# EasyEDA schematic SCH_Fermenter.json
TITLE: Fermentation Controller; REV: 1.0; Date: 2021-01-04; Sheet: 1/1; Drawn By: Mikael Hakansson; Company: Your Company
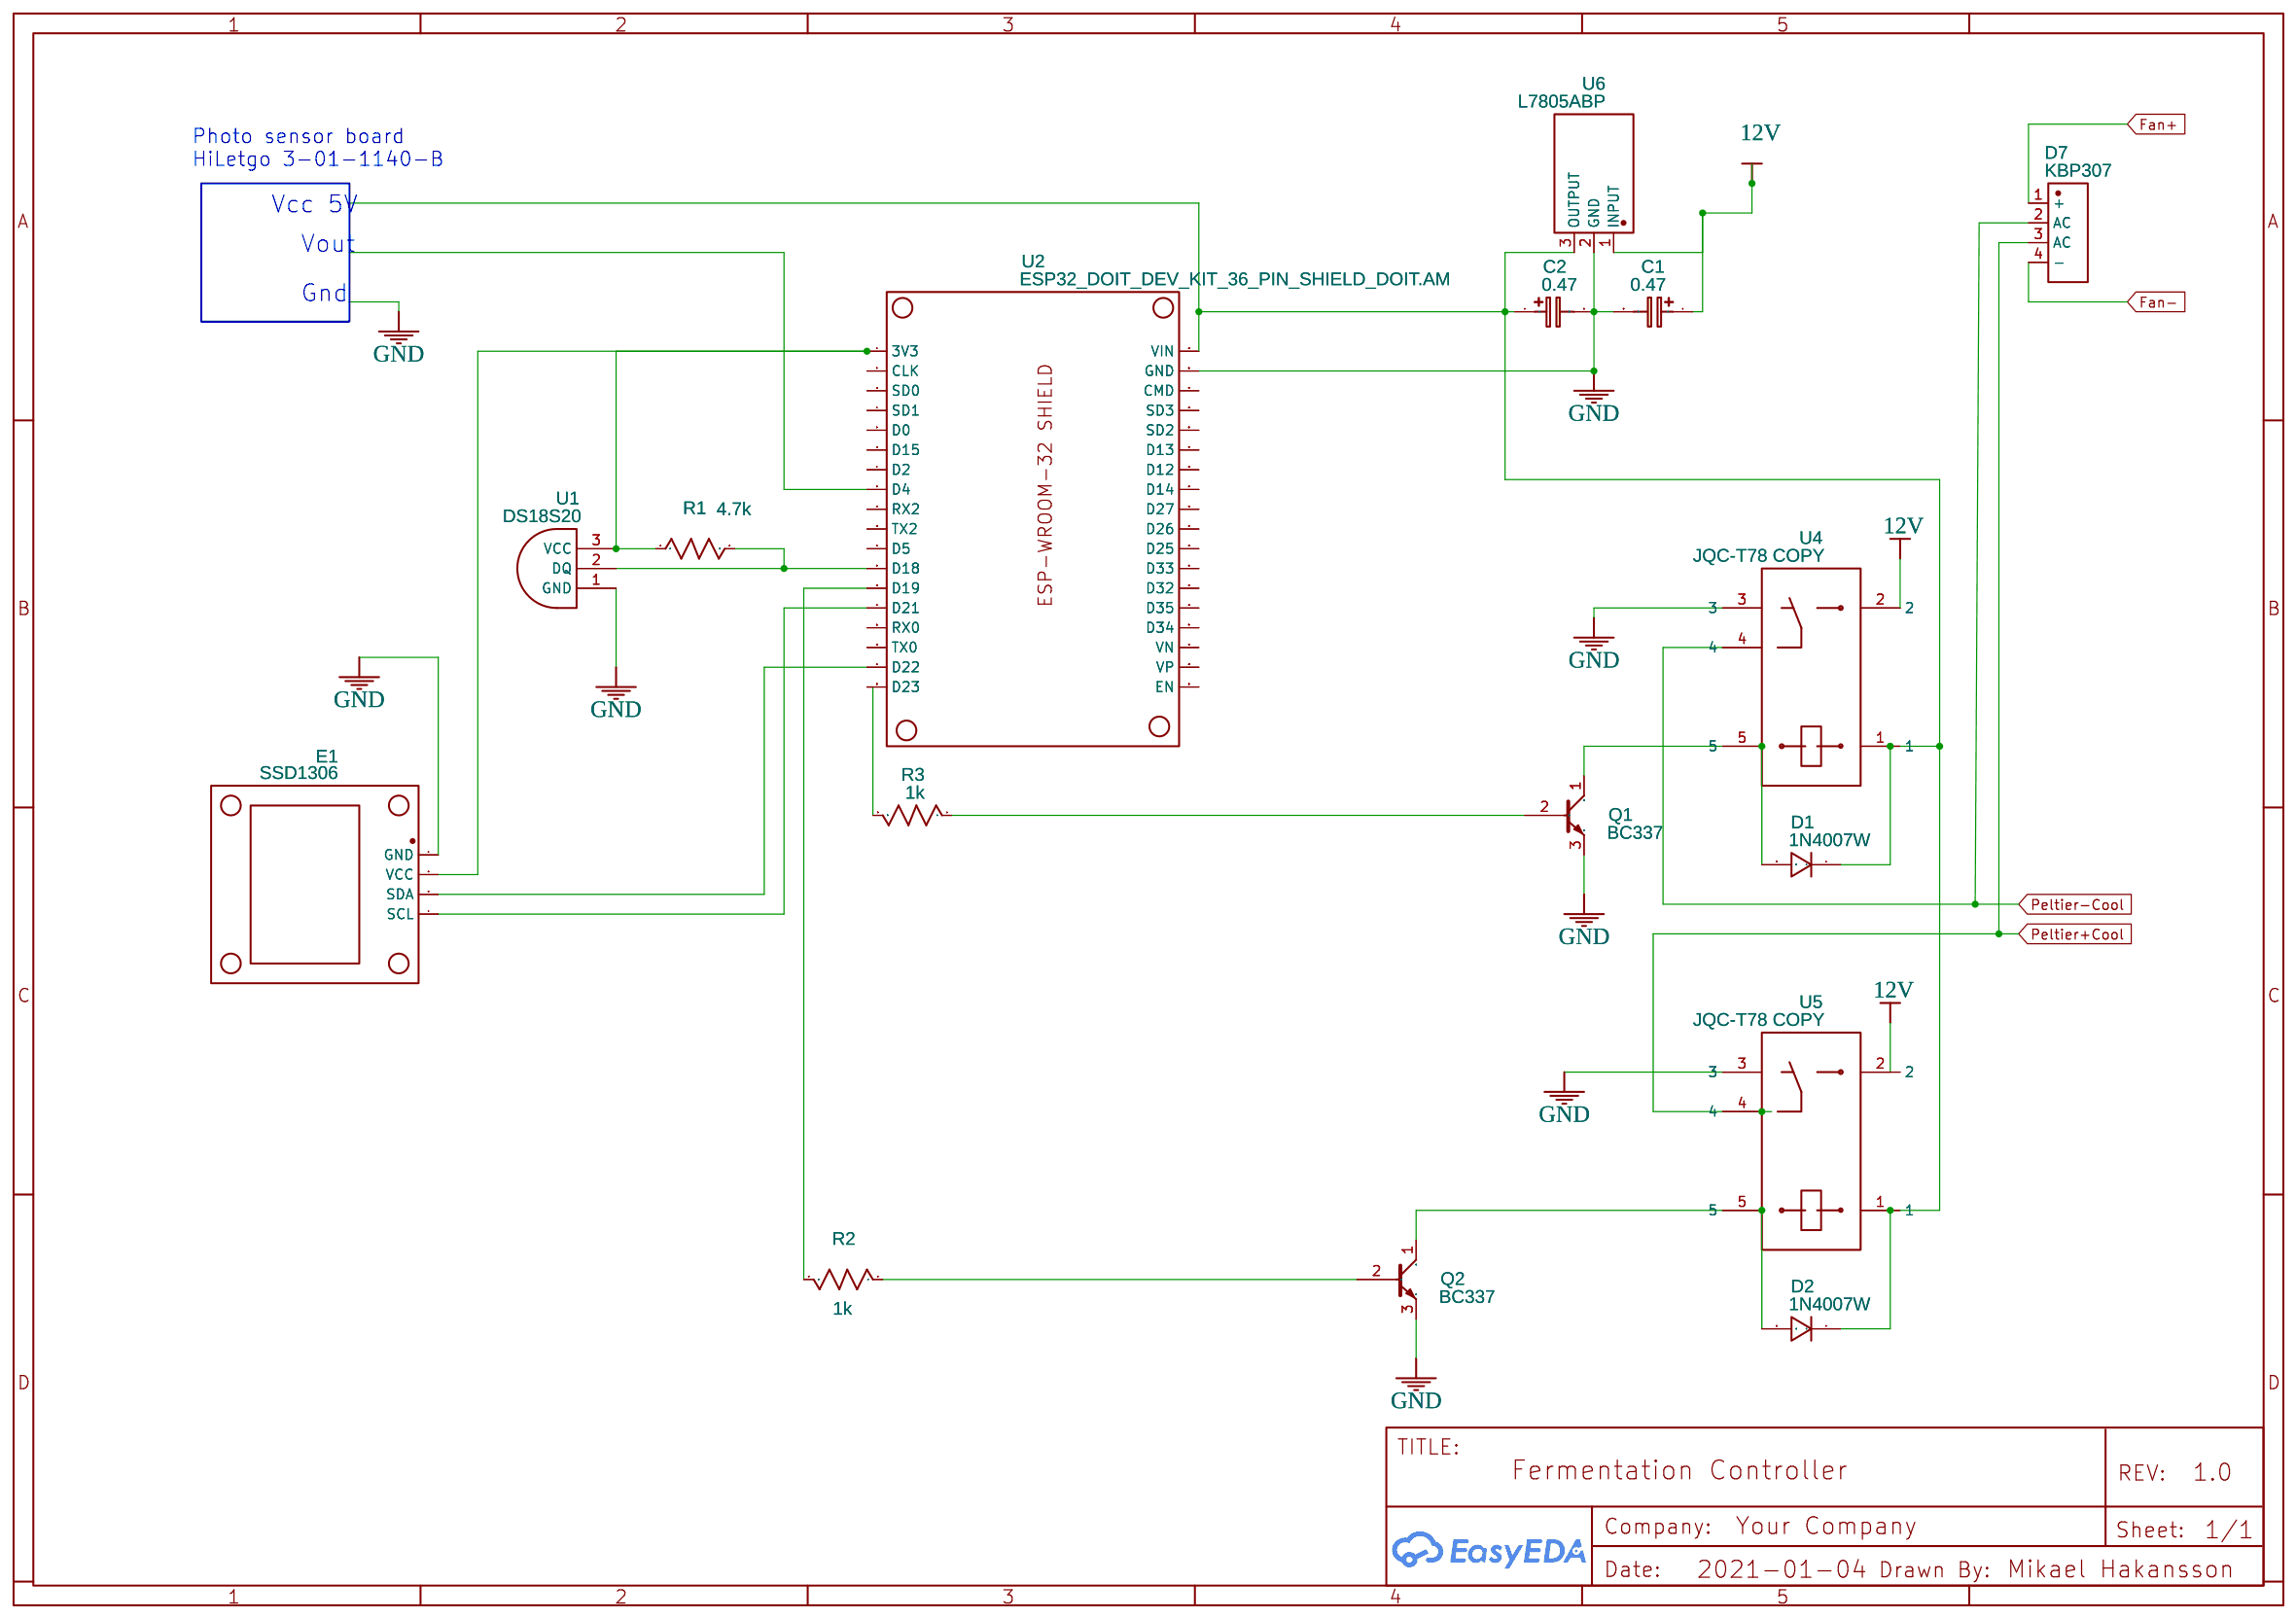
[diagram p0: schematic sheet]

## Parts
C1  0.47  [CASE-A_3216]
C2  0.47  [CASE-A_3216]
D1  1N4007W  [SOD-123_L2.8-W1.8-LS3.7-RD]
D2  1N4007W  [SOD-123_L2.8-W1.8-LS3.7-RD]
D7  KBP307  [KBP_4P-L14.8-W3.8-P3.85-L]
E1  SSD1306  [WJ2EDGVC-5.08-4P]
Q1  BC337  [TO-92_INLINE]
Q2  BC337  [TO-92_INLINE]
R1  4.7k  [AXIAL-6.5X2.3(1/4W)]
R2  1k  [R0603]
R3  1k  [R0603]
U1  DS18S20  [TO-92-3_L4.9-W3.7-P1.27-L]
U2  ESP32_DOIT_DEV_KIT_36_PIN_SHIELD_DOIT.AM  [ESP32_DOIT_DEVKIT_36_PIN]
U4  JQC-T78 COPY  [JQC-T78 COPY]
U5  JQC-T78 COPY  [JQC-T78 COPY]
U6  L7805ABP  [TO-220-3_L10.0-W4.5-P2.54-L]

## Library data of the parts
C1 C2 = C_Tan_SMD_A_EU: Contributor: LCEDA_Lib
D1 D2 = 1N4007W: Supplier: LCSC; Supplier Part: C328592; Manufacturer: BLUE ROCKET; Contributor: LCEDA_Lib
D7 = KBP307: Supplier: LCSC; Manufacturer: MDD; Supplier Part: C20648; JLCPCB Part Class: Extended Part
E1 = SSD1306: Supplier: LCSC; Manufacturer: ReliaPro; image: //image.lceda.cn/szlcsc/C8436.jpg; Supplier Part: C8436
Q1 Q2 = BC337: Contributor: Sanjay P Krishna
R1-R3 = R_0603_US: Contributor: LCEDA_Lib
U1 = DS18S20: Contributor: CodeWizard1975; Supplier: LCSC; Manufacturer: MAXIM; image: //image.lceda.cn/szlcsc/C52574.jpg; Supplier Part: C52574
U2 = ESP32_DOIT_DEV_KIT_36_PIN_SHIELD_DOIT.AM: Supplier: Mouser; Contributor: aloisiosjr
U4 U5 = JQC-T78 COPY: Contributor: AqibMalik
U6 = L7805ABP: Supplier: LCSC; Supplier Part: C2935188; Manufacturer: ST(意法半导体); Contributor: LCSC

## Nets
12V: C1.1 U4.2 U5.2 U6.1(INPUT)
GND: C1.2 C2.2 E1.1(GND) Q1.3(E) Q2.3(E) U1.1(GND) U2.35(GND) U4.3 U5.3 U6.2(GND)
Fan+: D7.1(+)
Fan-: D7.4(-)
Peltier+Cool: D7.3(AC) U5.4
Peltier-Cool: D7.2(AC) U4.4
Net-(C2-1): C2.1 D1.1 D2.1 U2.36(VIN) U4.1 U5.1 U6.3(OUTPUT)
Net-(D1-2): D1.2 Q1.1(C) U4.5
Net-(D2-2): D2.2 Q2.1(C) U5.5
Net-(E1-2): E1.2(VCC) R1.1 U1.3(VCC) U2.1(3V3)
Net-(E1-3): E1.3(SDA) U2.17(D22)
Net-(E1-4): E1.4(SCL) U2.14(D21)
Net-(Q1-2): Q1.2(B) R3.1
Net-(Q2-2): Q2.2(B) R2.1
Net-(R1-2): R1.2 U1.2(DQ) U2.12(D18)
Net-(R2-2): R2.2 U2.13(D19)
Net-(R3-2): R3.2 U2.18(D23)

Not connected (* = marked no-connect by the designer): U2 2(CLK) 3(SD0) 4(SD1) 5(D0) 6(D15) 7(D2) 8(D4) 9(RX2) 10(TX2) 11(D5) 15(RX0) 16(TX0) 19(EN) 20(VP) 21(VN) 22(D34) 23(D35) 24(D32) 25(D33) 26(D25) 27(D26) 28(D27) 29(D14) 30(D12) 31(D13) 32(SD2) 33(SD3) 34(CMD)

## Notes on the sheet
- Photo sensor board
  HiLetgo 3-01-1140-B
- Vcc 5V
- Vout
- Gnd
